# EAGLE schematic Automatic_Car (EAGLE 9.6.1)
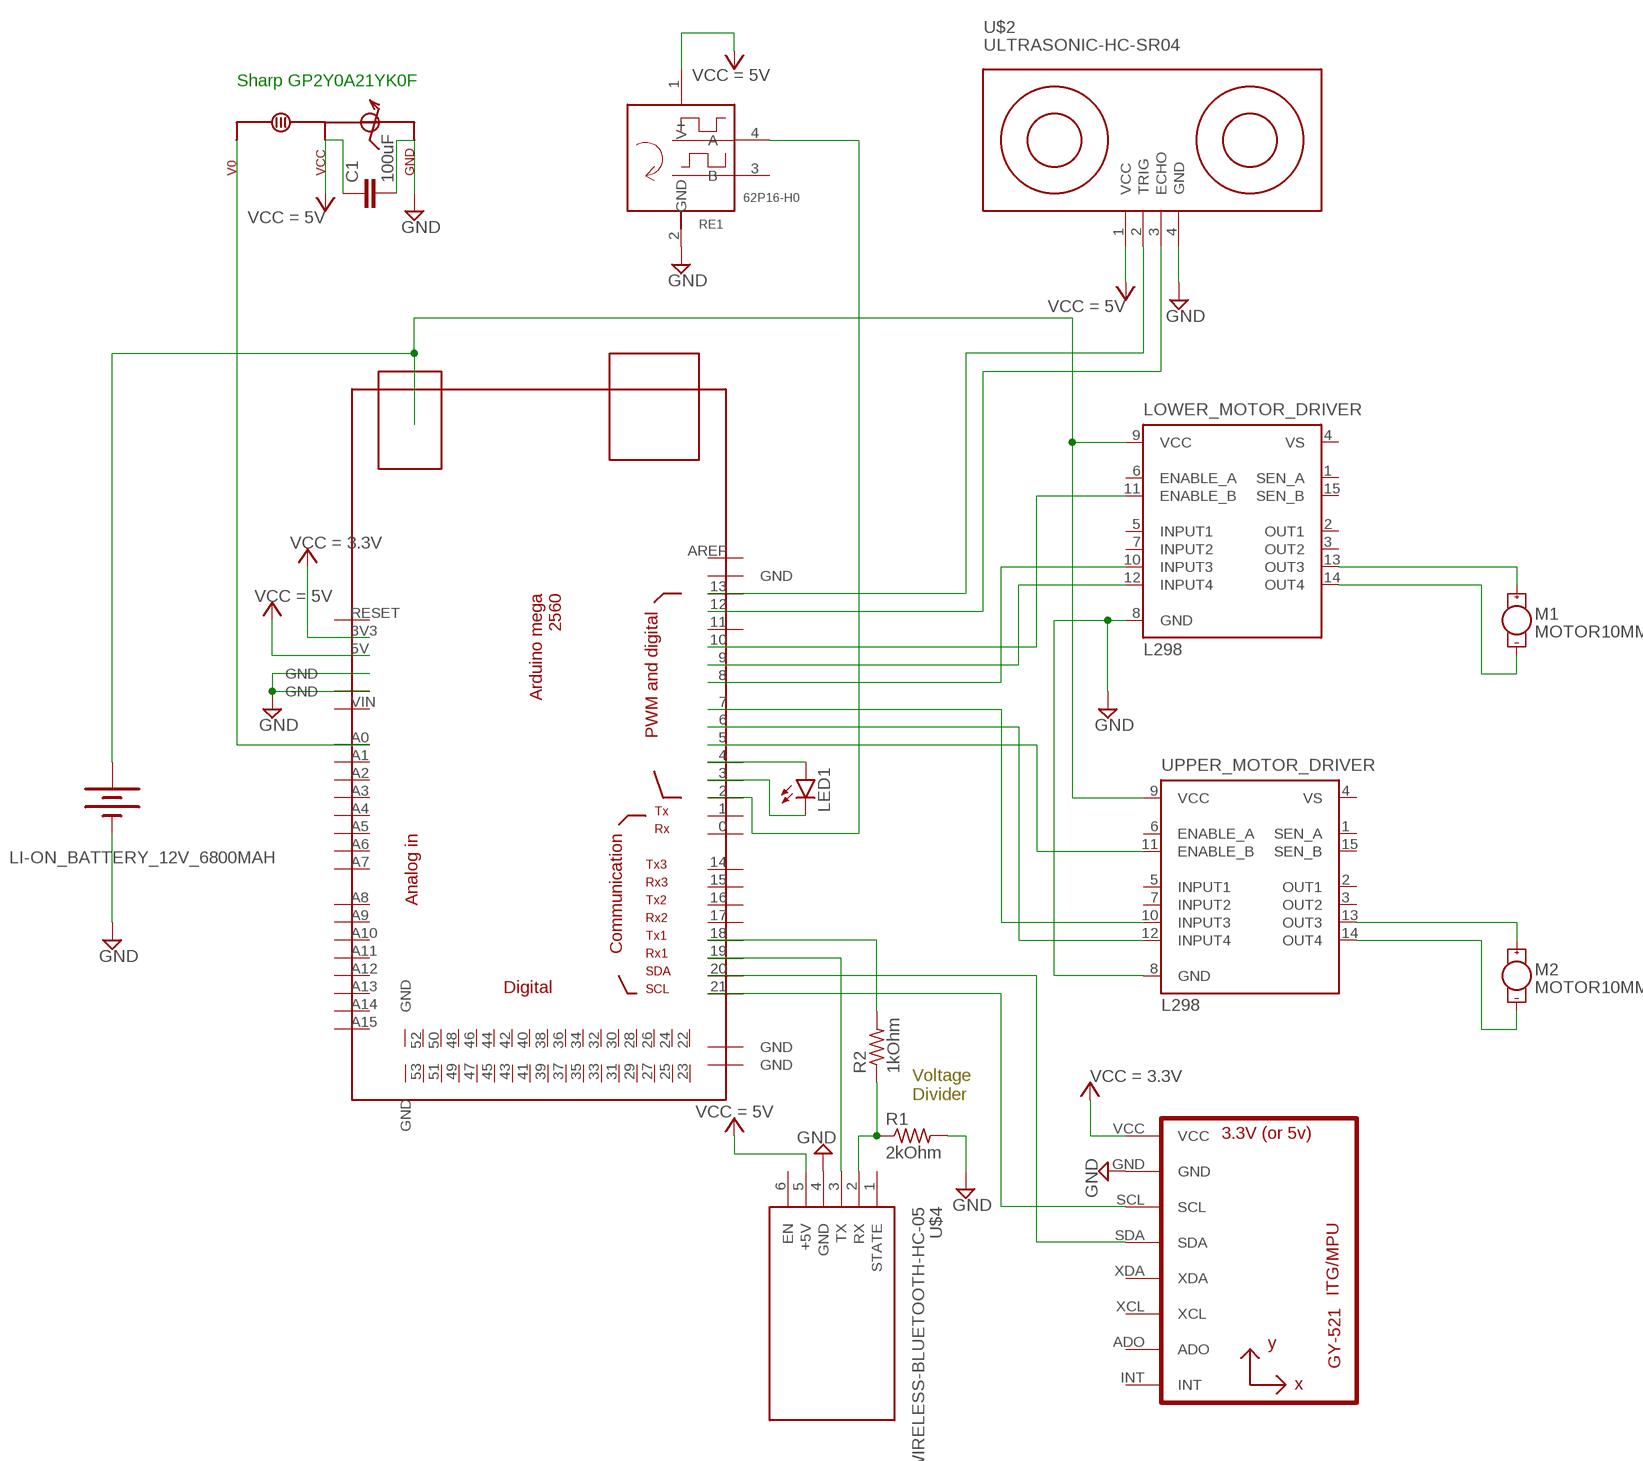
[diagram p0: schematic, sheet 1]

## Parts
C1  100uF  C2,5-3  [C2.5-3]
LED1  LAP4-BOTTOM  [P47F-BOTTOM]
LI-ON_BATTERY_12V_6800MAH  BATTERY-18650  [BATTERY_18650-HOLDER]
LOWER_MOTOR_DRIVER  L298  [MULTIWATT-15]
M1  MOTOR10MM  [VIBE-MOTOR-10MM]
M2  MOTOR10MM  [VIBE-MOTOR-10MM]
R1  2kOhm  R-US_0204/2V  [0204V]
R2  1kOhm  R-US_0204/2V  [0204V]
RE1  62P16-H0  [62P]
U1  GY-521MPU6050  [GY-521]
U$1  MEGA_DEVICE  [MEGAOUTLINE]
U$2  ULTRASONIC-HC-SR04  [ULTRASONIC-HC-SR04]
U$3  GP2Y0A21YK0F  [GP2Y0A21YK0F]
U$4  WIRELESS-BLUETOOTH-HC-05  [WIRELESS-BLUETOOTH-HC-05]
UPPER_MOTOR_DRIVER  L298  [MULTIWATT-15]

## Nets
GND: C1.2 LI-ON_BATTERY_12V_6800MAH.GND@1(-) LOWER_MOTOR_DRIVER.8(GND) R1.2 RE1.2(GND) U1.GND U$1.GND@2(GND) U$1.GND@3(GND) U$2.4(GND) U$4.4(GND) UPPER_MOTOR_DRIVER.8(GND)
N$1: LI-ON_BATTERY_12V_6800MAH.PWR@1(+) LOWER_MOTOR_DRIVER.9(VCC) UPPER_MOTOR_DRIVER.9(VCC)
N$2: U$1.5 UPPER_MOTOR_DRIVER.11(ENABLE_B)
N$3: U$1.6 UPPER_MOTOR_DRIVER.12(INPUT4)
N$4: U$1.7 UPPER_MOTOR_DRIVER.10(INPUT3)
N$5: LOWER_MOTOR_DRIVER.11(ENABLE_B) U$1.10
N$6: LOWER_MOTOR_DRIVER.12(INPUT4) U$1.9
N$7: LOWER_MOTOR_DRIVER.10(INPUT3) U$1.8
N$8: LOWER_MOTOR_DRIVER.13(OUT3) M1.+
N$9: LOWER_MOTOR_DRIVER.14(OUT4) M1.-
N$10: M2.+ UPPER_MOTOR_DRIVER.13(OUT3)
N$11: M2.- UPPER_MOTOR_DRIVER.14(OUT4)
N$12: U$1.13 U$2.2(TRIG)
N$13: U$1.12 U$2.3(ECHO)
N$14: U$1.A0
N$15: U1.SCL U$1.21
N$16: U1.SDA U$1.20
N$17: U$1.19 U$4.3(TX)
N$18: LED1.A U$1.4
N$19: R1.1 R2.1 U$4.2(RX)
N$20: R2.2 U$1.18
N$21: LED1.C U$1.3
N$22: RE1.4(A) U$1.2
VCC: C1.1 RE1.1(V+) U1.VCC U$1.3V3 U$1.5V U$2.1(VCC) U$4.5(+5V)
Unconnected: LOWER_MOTOR_DRIVER.1(SEN_A) LOWER_MOTOR_DRIVER.2(OUT1) LOWER_MOTOR_DRIVER.3(OUT2) LOWER_MOTOR_DRIVER.5(INPUT1) LOWER_MOTOR_DRIVER.6(ENABLE_A) LOWER_MOTOR_DRIVER.7(INPUT2) LOWER_MOTOR_DRIVER.15(SEN_B) RE1.3(B) U1.ADO U1.INT U1.XCL U1.XDA U$1.0 U$1.1 U$1.11 U$1.14 U$1.15 U$1.16 U$1.17 U$1.22 U$1.23 U$1.24 U$1.25 U$1.26 U$1.27 U$1.28 U$1.29 U$1.30 U$1.31 U$1.32 U$1.33 U$1.34 U$1.35 U$1.36 U$1.37 U$1.38 U$1.39 U$1.40 U$1.41 U$1.42 U$1.43 U$1.44 U$1.45 U$1.46 U$1.47 U$1.48 U$1.49 U$1.50 U$1.51 U$1.52 U$1.53 U$1.A1 U$1.A2 U$1.A3 U$1.A4 U$1.A5 U$1.A6 U$1.A7 U$1.A8 U$1.A9 U$1.A10 U$1.A11 U$1.A12 U$1.A13 U$1.A14 U$1.A15 U$1.AREF U$1.GND@1(GND) U$1.GND@4(GND) U$1.GND@5(GND) U$1.GND@6(GND) U$1.GND@7(GND) U$1.RESET U$1.VIN U$4.1(STATE) U$4.6(EN) UPPER_MOTOR_DRIVER.1(SEN_A) UPPER_MOTOR_DRIVER.2(OUT1) UPPER_MOTOR_DRIVER.3(OUT2) UPPER_MOTOR_DRIVER.5(INPUT1) UPPER_MOTOR_DRIVER.6(ENABLE_A) UPPER_MOTOR_DRIVER.7(INPUT2) UPPER_MOTOR_DRIVER.15(SEN_B)

## Notes on the sheet
- Sharp GP2Y0A21YK0F
- Voltage
  Divider

## Power pins joined to a net without a drawn wire
VS: LOWER_MOTOR_DRIVER.4(VS) UPPER_MOTOR_DRIVER.4(VS)

## Library data of the parts
C1 = capacitor-wima:C: CAPACITOR naming: grid - package width
LED1 = led:*P4: PointLED® Enhanced Thinfilm LED TOP & BOTTOM mount LS P47F, LR P47F, LA P47F, LY P47F, LT P4SG, LB P4SG, LW P4SG Source: http://catalog.osram-os.com .. LA_LR_LS_LY_P47F_Pb_free.pdf
LI-ON_BATTERY_12V_6800MAH = SparkFun-Batteries:BATTERY: Battery - Single Cell A variety of battery chemistries, sizes, and footprints. Device List: 20MM_PTH - Coin Cell Battery Holder - 20mm (PTH) <https://www.sparkfun.com/products/783> 6.8MM_PTH - Coin Cell Battery Holder - 6.8MM(SMD) <https://www.digikey.com/product-detail/en/seiko-instruments/MS621FE-FL11E/728-1057-ND/1889208?WT.srch=1&gclid=CNOQ5a6LzdQCFZS2wAodXCkE0g> 12MM_SMD - Coin Cell Battery Holder - 12mm (SMD) <https://www.sparkfun.com/products/10592> 12MM_PTH - Coin Cell Battery Holder - 12mm (PTH) <https://www.sparkfun.com/products/7948> 20MM_SMD - 20mm Coin Cell Battery Holder (SMD) (2 legs) Used on the Big Time Watch Kit <https://www.sparkfun.com/products/11734> 20MM_SMD_4LEGS - Coin Cell Battery Holder - 20mm (SMD) <https://www.sparkfun.com/products/11892> 20MM_SMD_4LEGS_OVERPASTE - Coin Cell Battery Holder - 20mm (SMD) <https://www.sparkfun.com/products/11892> (Over-paste on the legs) 24.5MM_PTH - Coin Cell Battery Holder - 24.5mm (PTH) <https://www.sparkfun.com/products/8863> 9V - 9V Battery Holder - PC Mount Used on the SparkFun SparkPunk Sound Kit <https://www.sparkfun.com/products/11177> and SparkFun SparkPunk Sequencer Kit <https://www.sparkfun.com/products/12707> 18650 - Battery Holder - 18650 (PTH) <https://www.sparkfun.com/products/13113> AA - Battery Holder - 1xAA (PTH) <https://www.sparkfun.com/products/7949> AAA - Battery Holder - 1xAAA (PTH) <https://www.sparkfun.com/products/12718> AA_KIT - Battery Holder - 1xAA (PTH) <https://www.sparkfun.com/products/7949> Special kit package - pads only have exposed copper on one side of the board. AAA_KIT - Battery Holder - 1xAAA (PTH) <https://www.sparkfun.com/products/12718> Special kit package - pads only have exposed copper on one side of the board.; PROD_ID: BATT-12327; SF_SKU: PRT-13113
LOWER_MOTOR_DRIVER UPPER_MOTOR_DRIVER = st-microelectronics:L298: DUAL FULL-BRIDGE DRIVER; MPN: L298N; OC_FARNELL: 1589425; OC_NEWARK: 32M1527
M1 M2 = SparkFun-Electromechanical:MOTOR: Motor (Single-Phase) Two-terminal, single-phase motors. SparkFun Products Vibration Motor <https://www.sparkfun.com/products/8449> (ROB-08449) Physical dimension and wire connections for this powerful vibration motor. Motor has a self adhesive backing.; PROD_ID: COMP-08572; SF_SKU: ROB-08449
R1 R2 = rcl:R-US_: RESISTOR, American symbol; SPICEPREFIX: R
RE1 = rotary-encoder:62P*0
U1 = gy-521:GY-521
U$1 = ArduinoMegaOutline:MEGA_DEVICE: mega card as device
U$2 = diy-modules:ULTRASONIC-HC-SR04: Ultrasonic Ranging Module HC-SR04 More details available here: http://randomnerdtutorials.com/complete-guide-for-ultrasonic-sensor-hc-sr04/ Click here to find device on ebay.com <http://www.ebay.com/sch/hc+sr04+ultrasonic>
U$3 = Clean-Kong:GP2Y0A21YK0F
U$4 = diy-modules-hc05:WIRELESS-BLUETOOTH-HC-05: Bluetooth Transceiver Module based on HC-05 board Tutorial is available here: https://arduino-info.wikispaces.com/BlueTooth-HC05-HC06-Modules-How-To Click here to find device on ebay.com <http://www.ebay.com/sch/hc-05+module+rs232>

## Module TEST
Ports: 

### Library data of the parts